# EAGLE design main (EAGLE 6.1)
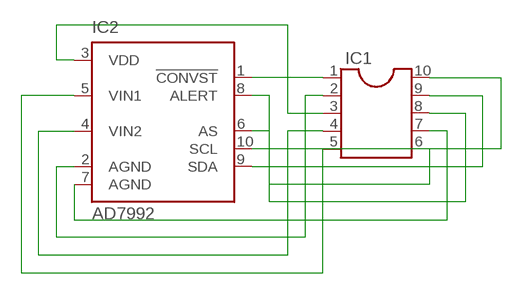
[diagram p0: schematic, sheet 1]

## Parts
IC1  DIL10  [DIL10]
IC2  AD7992  [MSOP10]

## Nets
N$1: IC1.1 IC2.1(!CONVST)
N$2: IC1.2 IC2.2(AGND)
N$3: IC1.3 IC2.3(VDD)
N$4: IC1.4 IC2.4(VIN2)
N$5: IC1.5 IC2.5(VIN1)
N$6: IC1.6 IC2.6(AS)
N$7: IC1.7 IC2.7(AGND)
N$8: IC1.8 IC2.8(ALERT)
N$9: IC1.9 IC2.9(SDA)
N$10: IC1.10 IC2.10(SCL)

## Library data of the parts
IC1 = ic-package:DIL10: Dual In Line / Socket
IC2 = analog-devices:AD7992: 2-Channel, 12-Bit ADC with I2C-Compatible Interface 10-Lead MSOP Source: http://www.analog.com/UploadedFiles/Data_Sheets/224965274AD7992_0.pdf; MPN: AD7992BRMZ-0; OC_FARNELL: 1078311; OC_NEWARK: 31M4422

## Board
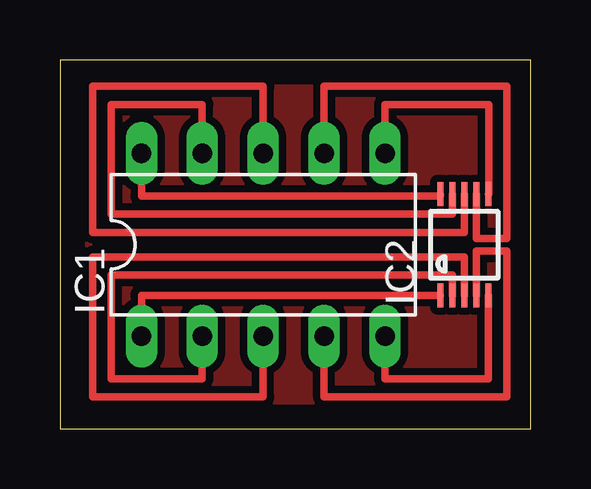
[diagram p1: board, top side]

Size 19.64 x 15.39 mm. Coordinates in mm from the lower left corner, seen from the top.
Outline: 0,0 19.64,0 19.64,15.39 0,15.39 0,0
Copper layers (1*16): Top 0.035mm / dielectric 1.5mm / Bottom 0.035mm
Design rules: minimum track width 10mil, minimum drill 24mil, track to track 8mil, track to pad 8mil, pad to pad 8mil, via to via 8mil, smd to smd 8mil, copper to edge 40mil, drill to drill 8mil, minimum pad ring 10mil, minimum via ring 8mil, stop-mask expansion 4mil, vias tented up to drill 0mil, thermal gap 10mil

### Footprints (pad centres in the part's own frame; a part is rotated, then mirrored left to right if it is on the bottom)
DIL10 = drill 0.813 long: 1 -5.08,-3.81; 2 -2.54,-3.81; 3 0,-3.81; 4 2.54,-3.81; 5 5.08,-3.81; 6 5.08,3.81; 7 2.54,3.81; 8 0,3.81; 9 -2.54,3.81; 10 -5.08,3.81
MSOP10 = smd 0.25 x 1: 1 -1,-2.113; 2 -0.5,-2.113; 3 0,-2.113; 4 0.5,-2.113; 5 1,-2.113; 6 1,2.113; 7 0.5,2.113; 8 0,2.113; 9 -0.5,2.113; 10 -1,2.113

### Placement (x,y rotation side)
IC1  8.48,7.68 0 top
IC2  16.86,7.68 0 top

### Tracks (layer width: path | path; a pad name or v marks a point on that pad's centre or on a via)
N$1
  Top 0.305: IC2.1 3.4,5.57 IC1.1
N$2
  Top 0.305: IC1.2 5.94,2.1 2.13,2.1 2.13,6.41 16.36,6.41 IC2.2
N$3
  Top 0.305: IC2.3 16.86,7.18 1.37,7.18 1.37,1.33 8.48,1.33 IC1.3
N$4
  Top 0.305: IC2.4 17.37,7.43 18.64,7.43 18.64,1.33 11.02,1.33 IC1.4
N$5
  Top 0.305: IC1.5 13.56,2.1 17.86,2.1 IC2.5
N$6
  Top 0.305: IC2.6 17.88,9.8 17.88,13.53 13.56,13.53 IC1.6
N$7
  Top 0.305: IC2.7 17.37,7.94 18.64,7.94 18.64,14.29 11.02,14.29 IC1.7
N$8
  Top 0.305: IC1.8 8.48,14.29 1.37,14.29 1.37,8.19 16.86,8.19 IC2.8
N$9
  Top 0.305: IC1.9 5.94,13.53 2.13,13.53 2.13,8.95 16.36,8.95 IC2.9
N$10
  Top 0.305: IC1.10 3.4,9.72 15.86,9.72 IC2.10
N$11
  pour Top (isolate 0.305): 0.1,15.3 19.65,15.3 19.4,0.06 0.1,0.06